# Altium schematic sheet ArduinoZeroV4.0_1.SchDoc: ArduinoZeroV4.0
size 409 x 289 mm; Origin: Eagle; Date: 2023-03-06 22:00:55; SheetNumber: 2; CODE-ARDUINO: DNP; DATASHEET: DNP; DISTRIBUTOR-LINK: DNP; DISTRIBUTOR-PN: DNP; MANUFACTURER: DNP; MANUFACTURER-PN: DNP; NOTE: DNP; Value: DNP; GateName_1: G$1; SymbolName_1: A3L-LOC; LibraryName: Arduino-utility; DeviceSetName: A3-FRAME; Sheet: Sheet:; ReferenceDesignsAREPROVIDED"ASIS"AND"WITHALLFAULTS.ArduinoSADISCLAIMSALLOTHERWARRANTIES,EXPRESSORIMPLIED,
REGARDINGPRODUCTS,INCLUDINGBUTNOTLIMITEDTO,ANYIMPLIEDWARRANTIESOFMERCHANTABILITYORFITNESSFORAPARTICULARPURPOSE

ArduinoSAmaymakechangestospecificationsandproductdescriptionsatanytime,withoutnotice.TheCustomermustnot
relyontheabsenceorcharacteristicsofanyfeaturesorinstructionsmarked"reserved"or"undefined."ArduinoSAreserves
theseforfuturedefinitionandshallhavenoresponsibilitywhatsoeverforconflictsorincompatibilitiesarisingfromfuturechangestothem.
TheproductinformationontheWebSiteorMaterialsissubjecttochangewithoutnotice.Donotfinalizeadesignwiththisinfo

ARDUINOandotherArduinobrandsandlogosandTrademarksofArduinoSA.AllArduinoSATrademarkscannotbeusedwithoutowner'sformalpermission: Reference Designs ARE PROVIDED "AS IS" AND "WITH ALL FAULTS. Arduino SA DISCLAIMS ALL OTHER WARRANTIES, EXPRESS OR IMPLIED, / REGARDING PRODUCTS, INCLUDING BUT NOT LIMITED TO, ANY IMPLIED WARRANTIES OF MERCHANTABILITY OR FITNESS FOR A PARTICULAR PURPOSE / Arduino SA may make changes to specifications and product descriptions at any time, without notice. The Customer must not / rely on the absence or characteristics of any features or instructions marked "reserved" or "undefined." Arduino SA reserves / these for future definition and shall have no responsibility whatsoever for conflicts or incompatibilities arising from future changes to them. / The product information on the Web Site or Materials is subject to change without notice. Do not finalize a design with this info / ARDUINO and other Arduino brands and logos and Trademarks of Arduino SA. All Arduino SA Trademarks cannot be used without owner's formal permission
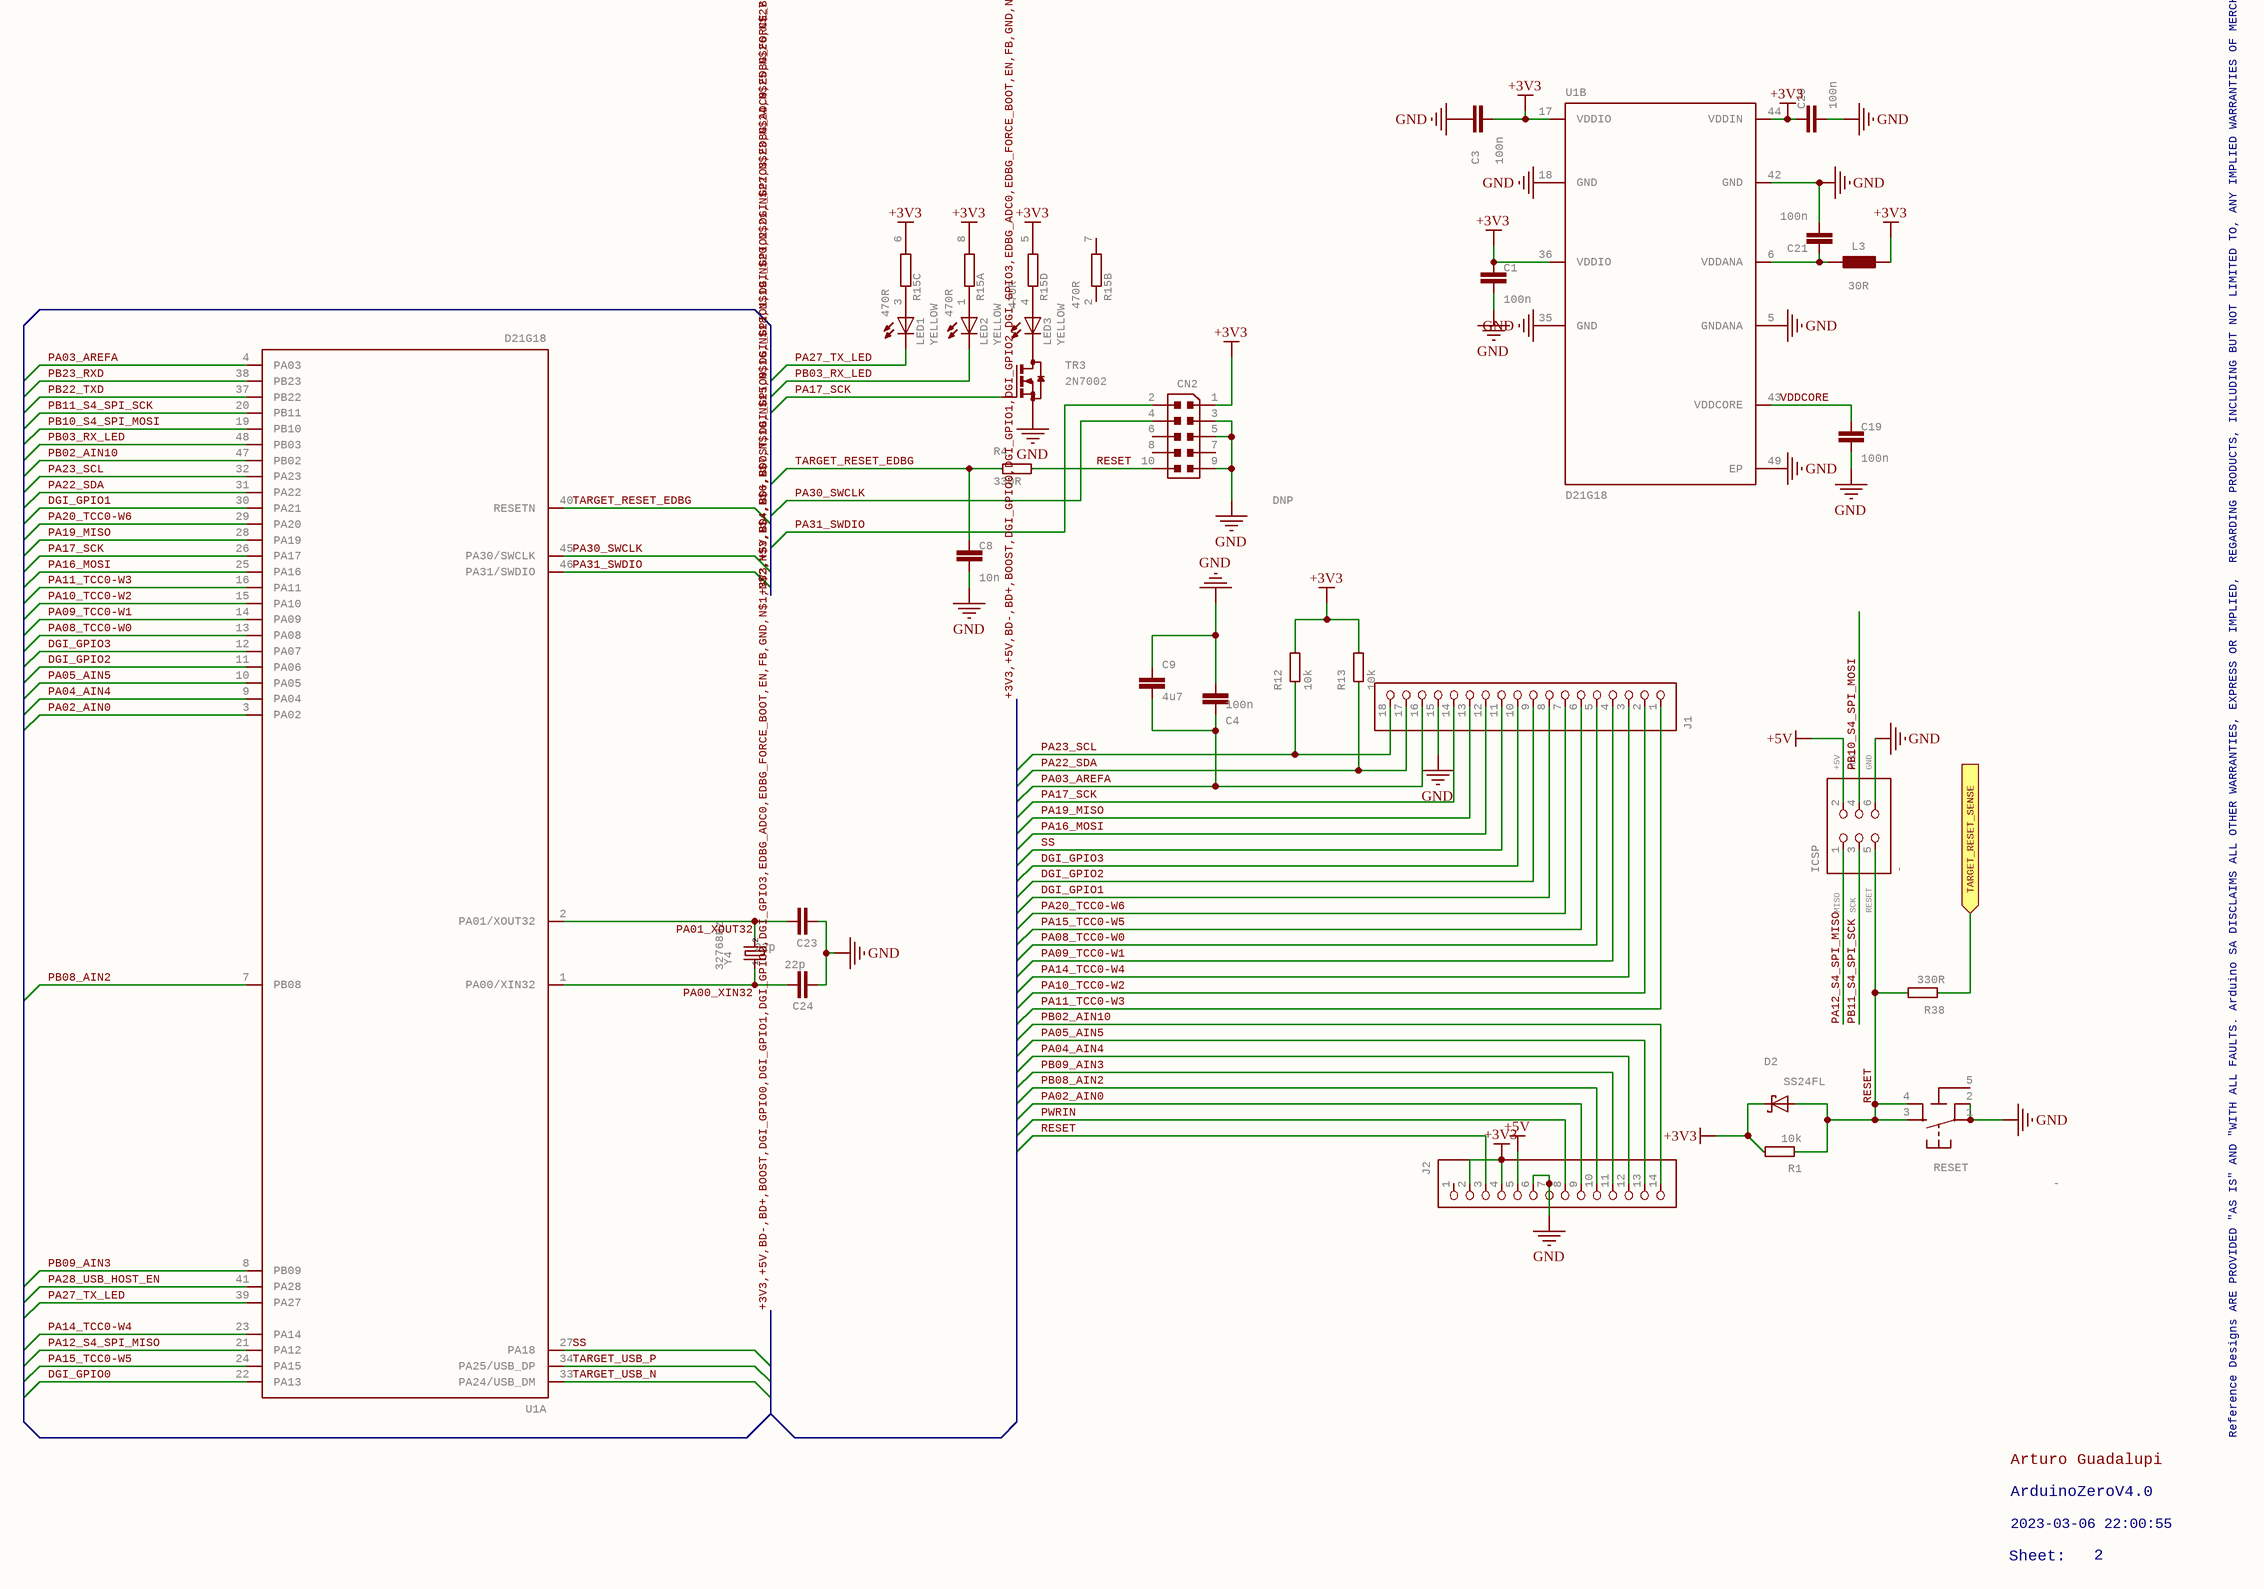
[diagram p0: ArduinoZeroV4.0_1.SchDoc]

## Parts
C1  100n  [0603-1608X90N]
C3  100n  [0603-1608X90N]
C4  100n  [0402-1005X55N]
C8  10n  [0603-1608X90N]
C9  4u7  [0603-1608X90N]
C19  100n  [0603-1608X90N]
C20  100n  [0603-1608X90N]
C21  100n  [0603-1608X90N]
C23  22p  [0603-1608X90N]
C24  22p  [0603-1608X90N]
CN2  DNP  [PINHEAD_2X05_127]
D2  SS24FL  [SOD123F]
ICSP  -  [2X03]
J1  -  [1X18-CUSTOM]  (value not drawn)
J2  -  [1X14-CUSTOM]  (value not drawn)
L3  30R  [0805-R2013X50N]
LED1  YELLOW  [CHIPLED_0805]
LED2  YELLOW  [CHIPLED_0805]
LED3  YELLOW  [CHIPLED_0805]
R1  10k  [C0603]
R4  330R  [C0603]
R12  10k  [C0603]
R13  10k  [C0603]
R15  470R  [CAY16]  (parts A,B,C,D of 4)
R38  330R  [C0603]
RESET  -  [TS42]
TR3  2N7002  [SOT23]
U1  D21G18  [QFN50P700X700X90-49XN-EPSQ515]  (parts A,B of 2)
Y4  32768Hz  [ABS07]

## Ports
TARGET_RESET_SENSE (in)

## Nets
+3V3: C1.1 C3.2 C20.1 CN2.1 D2.C J2.2 J2.4 L3.2 R1.2 R12.2 R13.2 R15.5 R15.6 R15.8 U1.17(VDDIO) U1.36(VDDIO) U1.44(VDDIN)
+5V: ICSP.2 J2.5
GND: C1.2 C3.1 C4.2 C8.2 C9.1 C19.2 C20.2 C21.2 C23.1 C24.1 CN2.3 CN2.5 CN2.9 ICSP.6 J1.15 J2.6 J2.7 RESET.1 RESET.2 TR3.2(S) U1.5(GNDANA) U1.18(GND) U1.35(GND) U1.42(GND) U1.49(EP)
DGI_GPIO0: U1.22(PA13)
DGI_GPIO1: J1.8 U1.30(PA21)
DGI_GPIO2: J1.9 U1.11(PA06)
DGI_GPIO3: J1.10 U1.12(PA07)
PA00_XIN32: C24.2 U1.1(PA00/XIN32) Y4.1
PA01_XOUT32: C23.2 U1.2(PA01/XOUT32) Y4.2
PA02_AIN0: J2.9 U1.3(PA02)
PA03_AREFA: C4.1 C9.2 J1.16 U1.4(PA03)
PA04_AIN4: J2.12 U1.9(PA04)
PA05_AIN5: J2.13 U1.10(PA05)
PA08_TCC0-W0: J1.5 U1.13(PA08)
PA09_TCC0-W1: J1.4 U1.14(PA09)
PA10_TCC0-W2: J1.2 U1.15(PA10)
PA11_TCC0-W3: J1.1 U1.16(PA11)
PA12_S4_SPI_MISO: ICSP.1 U1.21(PA12)
PA14_TCC0-W4: J1.3 U1.23(PA14)
PA15_TCC0-W5: J1.6 U1.24(PA15)
PA16_MOSI: J1.12 U1.25(PA16)
PA17_SCK: J1.14 TR3.1(G) U1.26(PA17)
PA19_MISO: J1.13 U1.28(PA19)
PA20_TCC0-W6: J1.7 U1.29(PA20)
PA22_SDA: J1.17 R13.1 U1.31(PA22)
PA23_SCL: J1.18 R12.1 U1.32(PA23)
PA27_TX_LED: LED1.C U1.39(PA27)
PA28_USB_HOST_EN: U1.41(PA28)
PA30_SWCLK: CN2.4 U1.45(PA30/SWCLK)
PA31_SWDIO: CN2.2 U1.46(PA31/SWDIO)
PB02_AIN10: J2.14 U1.47(PB02)
PB03_RX_LED: LED2.C U1.48(PB03)
PB08_AIN2: J2.10 U1.7(PB08)
PB09_AIN3: J2.11 U1.8(PB09)
PB10_S4_SPI_MOSI: ICSP.4 U1.19(PB10)
PB11_S4_SPI_SCK: ICSP.3 U1.20(PB11)
PB22_TXD: U1.37(PB22)
PB23_RXD: U1.38(PB23)
PWRIN: J2.8
RESET: CN2.10 D2.A ICSP.5 J2.3 R1.1 R4.2 R38.2 RESET.3 RESET.4
SS: J1.11 U1.27(PA18)
TARGET_RESET_EDBG: C8.1 R4.1 U1.40(RESETN)
TARGET_RESET_SENSE: R38.1 ; port TARGET_RESET_SENSE
TARGET_USB_N: U1.33(PA24/USB_DM)
TARGET_USB_P: U1.34(PA25/USB_DP)
VDDCORE: C19.1 U1.43(VDDCORE)
NetC21_1: C21.1 L3.1 U1.6(VDDANA)
NetLED1_A: LED1.A R15.3
NetLED2_A: LED2.A R15.1
NetLED3_A: LED3.A R15.4
NetLED3_C: LED3.C TR3.3(D)

Not connected (* = marked no-connect by the designer): CN2 6 7 8; J2 1; R15 2(1) 7(2); RESET 5(5-GND)

## Buses and harness runs
bus +3V3,+5V,BD-,BD+,BOOST,DGI_GPIO0,DGI_GPIO1,DGI_GPIO2,DGI_GPIO3,EDBG_ADC0,EDBG_FORCE_BOOT,EN,FB,GND,N$1,N$2,N$3,N$4,N$6,N$7,N$10,N$15,N$16,N$18,N$19,N$20,N$21,N$22,N$23,N$24,N$25,N$26,N$27,N$34,N$37,N$38,N$39,N$40,N$41,N$42,N$43,N$44,N$45,N$57,N$58,N$59,N$60,N$61,N$67,N$68,PA00_XIN32,PA01_XOUT32,PA02_AIN0,PA03_AREFA,PA04_AIN4,PA05_AIN5,PA08_TCC0-W0,PA09_TCC0-W1,PA10_TCC0-W2,PA11_TCC0-W3,PA12_S4_SPI_MISO,PA14_TCC0-W4,PA15_TCC0-W5,PA16_MOSI,PA17_SCK,PA19_MISO,PA20_TCC0-W6,PA22_SDA,PA23_SCL,PA27_TX_LED,PA28_USB_HOST_EN,PA30_SWCLK,PA31_SWDIO,PB02_AIN10,PB03_RX_LED,PB08_AIN2,PB09_AIN3,PB10_S4_SPI_MOSI,PB11_S4_SPI_SCK,PB22_TXD,PB23_RXD,POWER_LED_CTRL,PWRIN,RESET,SS,STATUS_LED_CTRL,SW,TARGET_RESET_EDBG,TARGET_RESET_SENSE,TARGET_USB_N,TARGET_USB_P,USBVCC,VCC_EDBG_3V3,VCC_EDBG_USB,VDDCORE,VIN_SW,XUSB,XVCC

## Notes on the sheet
- Reference Designs ARE PROVIDED "AS IS" AND "WITH ALL FAULTS. Arduino SA DISCLAIMS ALL OTHER WARRANTIES, EXPRESS OR IMPLIED,
  REGARDING PRODUCTS, INCLUDING BUT NOT LIMITED TO, ANY IMPLIED WARRANTIES OF MERCHANTABILITY OR FITNESS FOR A PARTICULAR PURPOSE
  Arduino SA may make changes to specifications and product descriptions at any time, without notice. The Customer must not
  rely on the absence or characteristics of any features or instructions marked "reserved" or "undefined." Arduino SA reserves
  these for future definition and shall have no responsibility whatsoever for conflicts or incompatibilities arising from future changes to them.
  The product information on the Web Site or Materials is subject to change without notice. Do not finalize a design with this info
  ARDUINO and other Arduino brands and logos and Trademarks of Arduino SA. All Arduino SA Trademarks cannot be used without owner's formal permission
- Arturo Guadalupi
- ArduinoZeroV4.0
- Sheet:
- 2023-03-06 22:00:55
- 2

## Library data of the parts
C1 C3 C19-C21 = C-0603: SMD Capacitor; MANUFACTURER: Murata; MANUFACTURER-PN: GRM188R71C104KA01D; GateName_1: G$1; SymbolName_1: C; DeviceName: -0603; CODE-ARDUINO: 0015; PN-ALTERNATIVE1: NMC0603Y5V104Z25TRPF; PN-ALTERNATIVE2: C1608F104Z500NT; PN-ALTERNATIVE3: C0603C104K3RAC7411; PN-ALTERNATIVE4: 06035D104KAT2A; PN-ALTERNATIVE5: 0603B104K500CT; LibraryName: Arduino-rcl; DeviceSetName: C; DATASHEET: http://search.murata.co.jp/Ceramy/image/img/A01X/G101/ENG/GRM188R71C104KA01-01.pdf; DISTRIBUTOR-LINK: https://www.digikey.com/product-detail/en/murata-electronics-north-america/GRM188R71C104KA01D/490-1532-1-ND/587771; DISTRIBUTOR-PN: 490-1532-2-ND; NOTE: -
C4 = C-0402: SMD Capacitor; MANUFACTURER: TDK; MANUFACTURER-PN: C1005X5R1H104K050BB; GateName_1: G$1; SymbolName_1: C; DeviceName: -0402; CODE-ARDUINO: 0132; LibraryName: Arduino-rcl; DeviceSetName: C; DATASHEET: http://www.tdk.com/pdf/TDKMLCCCapRange.pdf; DISTRIBUTOR-LINK: http://www.digikey.com/product-detail/en/tdk-corporation/C1005X5R1H104K050BB/445-5942-1-ND/2443982; DISTRIBUTOR-PN: 445-5942-1-ND; NOTE: -
C8 = C-0603: SMD Capacitor; MANUFACTURER: Murata; MANUFACTURER-PN: GRM188R71H103KA01D; GateName_1: G$1; SymbolName_1: C; DeviceName: -0603; CODE-ARDUINO: 0142; LibraryName: Arduino-rcl; DeviceSetName: C; DATASHEET: http://www.murata.com/~/media/webrenewal/support/library/catalog/products/capacitor/mlcc/c02e.pdf; DISTRIBUTOR-LINK: https://www.digikey.com/product-detail/en/murata-electronics-north-america/GRM188R71H103KA01D/490-1512-1-ND/587862; DISTRIBUTOR-PN: 490-1512-1-ND; NOTE: -; PN-ALTERNATIVE1: PN-ALTERNATIVE1; PN-ALTERNATIVE2: PN-ALTERNATIVE2; PN-ALTERNATIVE3: PN-ALTERNATIVE3; PN-ALTERNATIVE4: PN-ALTERNATIVE4; PN-ALTERNATIVE5: PN-ALTERNATIVE5
C9 = C-0603: SMD Capacitor; MANUFACTURER: Murata; MANUFACTURER-PN: GRM188R61E475KE11D; GateName_1: G$1; SymbolName_1: C; DeviceName: -0603; CODE-ARDUINO: 0458; LibraryName: Arduino-rcl; DeviceSetName: C; DATASHEET: http://www.murata.com/~/media/webrenewal/support/library/catalog/products/capacitor/mlcc/c02e.pdf; DISTRIBUTOR-LINK: http://www.digikey.com/product-search/en?keywords=490-7203-1-ND; DISTRIBUTOR-PN: 490-7203-1-ND; NOTE: -; PN-ALTERNATIVE1: PN-ALTERNATIVE1; PN-ALTERNATIVE2: PN-ALTERNATIVE2; PN-ALTERNATIVE3: PN-ALTERNATIVE3; PN-ALTERNATIVE4: PN-ALTERNATIVE4; PN-ALTERNATIVE5: PN-ALTERNATIVE5
C23 C24 = C-0603: SMD Capacitor; MANUFACTURER: Samsung; MANUFACTURER-PN: CL10C220JB8NNNC; GateName_1: G$1; SymbolName_1: C; DeviceName: -0603; CODE-ARDUINO: 0014; PN-ALTERNATIVE1: 0603N220J500CT; LibraryName: Arduino-rcl; DeviceSetName: C; DATASHEET: http://www.samsungsem.com/kr/support/product-search/mlcc/__icsFiles/afieldfile/2016/08/18/S_CL10C220JB8NNNC.pdf; DISTRIBUTOR-LINK: https://www.digikey.com/product-detail/en/samsung-electro-mechanics-america-inc/CL10C220JB8NNNC/1276-1023-1-ND/3889109; DISTRIBUTOR-PN: 1276-1023-1-ND; NOTE: -; PN-ALTERNATIVE2: PN-ALTERNATIVE2; PN-ALTERNATIVE3: PN-ALTERNATIVE3; PN-ALTERNATIVE4: PN-ALTERNATIVE4; PN-ALTERNATIVE5: PN-ALTERNATIVE5
CN2 = JTAG_CONNECTOR-DNP: 2x5 PASSO 1,27; GateName_1: G$1; DeviceName: -DNP; SymbolName_1: PINHEAD_2X05_127; LibraryName: Arduino-connectors; DeviceSetName: JTAG_CONNECTOR; CODE-ARDUINO: DNP; DATASHEET: DNP; DISTRIBUTOR-LINK: DNP; DISTRIBUTOR-PN: DNP; MANUFACTURER: DNP; MANUFACTURER-PN: DNP
D2 = SS24FL: Schottky diode; MANUFACTURER: Fairchild; GateName_1: G$1; SymbolName_1: SCHOTTKY-1; CODE-ARDUINO: 0025; LibraryName: Arduino-diodes; DeviceSetName: SS24FL; DATASHEET: https://www.fairchildsemi.com/datasheets/SS/SS24FL.pdf; DISTRIBUTOR-LINK: https://www.digikey.com/product-detail/en/fairchild-on-semiconductor/SS24FL/SS24FLCT-ND/5305093; DISTRIBUTOR-PN: SS24FLCT-ND; MANUFACTURER-PN: SS24FL
ICSP = PINHD-2X03-ICSPTH: PIN HEADER; MANUFACTURER: Adam Tech; MANUFACTURER-PN: RSE2-1-06-SG-1; GateName_1: G$1; SymbolName_1: PINH-2X03-ICSP; DeviceName: TH; CODE-ARDUINO: 0119; LibraryName: Arduino-connectors; DeviceSetName: PINHD-2X03-ICSP; MISO: MISO; SCK: SCK; RESET: RESET; +5V: +5V; MOSI: MOSI; GND: GND; DATASHEET: DATASHEET; DISTRIBUTOR-LINK: DISTRIBUTOR-LINK; DISTRIBUTOR-PN: DISTRIBUTOR-PN
J1 = PINHD-1X18-CUSTOM_OLD: Pin header; GateName_1: A; CODE-ARDUINO: 3648; SymbolName_1: PINHD-1X18; DeviceName: -CUSTOM_OLD; LibraryName: Arduino-connectors; DeviceSetName: PINHD-1X18; DATASHEET: -; DISTRIBUTOR-LINK: -; DISTRIBUTOR-PN: -; MANUFACTURER-PN: -; MANUFCATURER: -; NOTE: -
J2 = PINHD-1X14-CUSTOM_OLD: PIN HEADER; GateName_1: A; CODE-ARDUINO: 3649; SymbolName_1: PINHD-1X14; DeviceName: -CUSTOM_OLD; LibraryName: Arduino-connectors; DeviceSetName: PINHD-1X14; DATASHEET: -; DISTRIBUTOR-LINK: -; DISTRIBUTOR-PN: -; MANUFACTURER: -; MANUFACTURER-PN: -; NOTE: -
L3 = FERRITE0805: SMD ferrite; MANUFACTURER: Murata; MANUFACTURER-PN: BLM21PG300SN1D; GateName_1: >NAME; DeviceName: 0805; CODE-ARDUINO: 0001; PN-ALTERNATIVE1: MH2029-300Y; SymbolName_1: FERRITE; LibraryName: Arduino-rcl; DeviceSetName: FERRITE; DATASHEET: https://www.murata.com/en-us/products/productdata/8796738977822/ENFA0005.pdf; DISTRIBUTOR-LINK: https://www.digikey.it/product-detail/en/murata-electronics-north-america/BLM21PG300SN1D/490-1052-1-ND/584499; DISTRIBUTOR-PN: 490-1052-1-ND
LED1-LED3 = LED-0805: LED; MANUFACTURER: Lite-On; MANUFACTURER-PN: LTST-C170YKT; GateName_1: G$1; DeviceName: -0805; CODE-ARDUINO: 0044; PN-ALTERNATIVE1: KPT-2012YC; SymbolName_1: LED; LibraryName: Arduino-diodes; DeviceSetName: LED; DATASHEET: https://media.digikey.com/pdf/Data%20Sheets/Lite-On%20PDFs/LTST-C170GKT.pdf; DISTRIBUTOR-LINK: https://www.digikey.com/product-detail/it/lite-on-inc/LTST-C170YKT/160-1175-1-ND/269247; DISTRIBUTOR-PN: 160-1175-1-ND
R1 R12 R13 = R-0603: SMD Resistor; MANUFACTURER: Yageo; MANUFACTURER-PN: RC0603JR-0710KL; GateName_1: G$1; SymbolName_1: R; DeviceName: -0603; CODE-ARDUINO: 0028; NOTE: NO; LibraryName: Arduino-rcl; DeviceSetName: R; DATASHEET: http://www.yageo.com/documents/recent/PYu-RC_Group_51_RoHS_L_8.pdf; DISTRIBUTOR-LINK: https://www.digikey.com/product-detail/en/yageo/RC0603JR-0710KL/311-10KGRCT-ND/729647; DISTRIBUTOR-PN: 311-10KGRCT-ND; PN-ALTERNATIVE1: -
R4 R38 = R-0603: SMD Resistor; MANUFACTURER: Yageo; MANUFACTURER-PN: RC0603FR-07330RL; GateName_1: G$1; SymbolName_1: R; DeviceName: -0603; CODE-ARDUINO: 0049; NOTE: NO; LibraryName: Arduino-rcl; DeviceSetName: R; DATASHEET: http://www.yageo.com/documents/recent/PYu-RC_Group_51_RoHS_L_10.pdf; DISTRIBUTOR-LINK: https://www.digikey.com/product-detail/en/yageo/RC0603FR-07330RL/311-330HRCT-ND/730109; DISTRIBUTOR-PN: 311-330HRCT-ND; PN-ALTERNATIVE1: -
R15 = 4R-NCAY16: Array Chip Resistor   Source: RS Component / Phycomp; MANUFACTURER: Bourns Inc.; MANUFACTURER-PN: CAY16-471J4LF; GateName_1: A; SymbolName_1: R1NV; GateName_2: B; GateName_3: C; GateName_4: D; DeviceSetName: 4R-N; CODE-ARDUINO: 0540; RESTRICTIONS: NO; SymbolName_2: R1NV; SymbolName_3: R1NV; SymbolName_4: R1NV; DeviceName: CAY16; LibraryName: Arduino-rcl; DATASHEET: http://www.bourns.com/docs/Product-Datasheets/CATCAY.pdf; DISTRIBUTOR-LINK: https://www.digikey.com/product-detail/en/bourns-inc/CAY16-471J4LF/CAY16-471J4LFCT-ND/3437962; DISTRIBUTOR-PN: CAY16-471J4LFCT-ND; PN-ALTERNATIVE1: PN-ALTERNATIVE1
RESET = TACTILE2: Pushbutton; MANUFACTURER: TE; MANUFACTURER-PN: FSM14JSMAS; GateName_1: G$1; SymbolName_1: TACTILE-5PINS; LibraryName: Arduino-pushbuttons; DeviceSetName: TACTILE2; CODE-ARDUINO: -; DATASHEET: http://www.te.com/commerce/DocumentDelivery/DDEController?Action=srchrtrv&DocNm=1977223&DocType=Customer+Drawing&DocLang=English; DISTRIBUTOR-LINK: https://www.digikey.com/product-detail/en/te-connectivity-alcoswitch-switches/FSM14JSMAS/450-2161-ND/5343810; DISTRIBUTOR-PN: 450-2161-ND; PN-ALTERNATIVE1: PN-ALTERNATIVE1
TR3 = 2N7002T-SOT23: MOSFET N-CH 60V 115MA; MANUFACTURER: Micro Commercial Co; MANUFACTURER-PN: 2N7002-TP; GateName_1: G$1; SymbolName_1: N-MOS-1; DeviceName: -SOT23; CODE-ARDUINO: 1612; LibraryName: Arduino-transistors; DeviceSetName: 2N7002T; DATASHEET: http://www.mccsemi.com/up_pdf/2N7002(SOT-23).PDF; DISTRIBUTOR-LINK: https://www.digikey.com/product-detail/it/micro-commercial-co/2N7002-TP/2N7002-TPMSCT-ND/1960099; DISTRIBUTOR-PN: 2N7002-TPMSCT-ND
U1 = ATSAMD21G18A-48QFN: ARMÂ® CortexÂ®-M0+ SAM D21G Microcontroller IC 32-Bit 48MHz 256KB (256K x 8) FLASH 48-TQFP (7x7); GateName_1: A; SymbolName_1: ATSAMD21G18A-48-A; GateName_2: B; SymbolName_2: ATSAMD21G18A-48-B; DeviceName: QFN; CODE-ARDUINO: DNP; LibraryName: Arduino-ucs&SoCs; DeviceSetName: ATSAMD21G18A-48; DATASHEET: DNP; DISTRIBUTOR-LINK: DNP; DISTRIBUTOR-PN: DNP; MANUFACTURER: DNP; MANUFACTURER-PN: DNP
Y4 = 32.768KHZ: LF crystal; MANUFACTURER: Abracon LLC; MANUFACTURER-PN: ABS07-32.768KHZ-T; GateName_1: G$1; SymbolName_1: Q; CODE-ARDUINO: 0213; LibraryName: Arduino-crystals; DeviceSetName: 32.768KHZ; 1: 1; 2: 2; DATASHEET: http://www.abracon.com/Resonators/ABS07.pdf; DISTRIBUTOR-LINK: http://www.digikey.com/product-detail/en/abracon-llc/ABS07-32.768KHZ-T/535-9542-1-ND/1237009; DISTRIBUTOR-PN: 535-9542-1-ND